# Altium schematic sheet KEYBOARD.SchDoc
size A4; DrawnBy: SURAJ; SheetNumber: 4
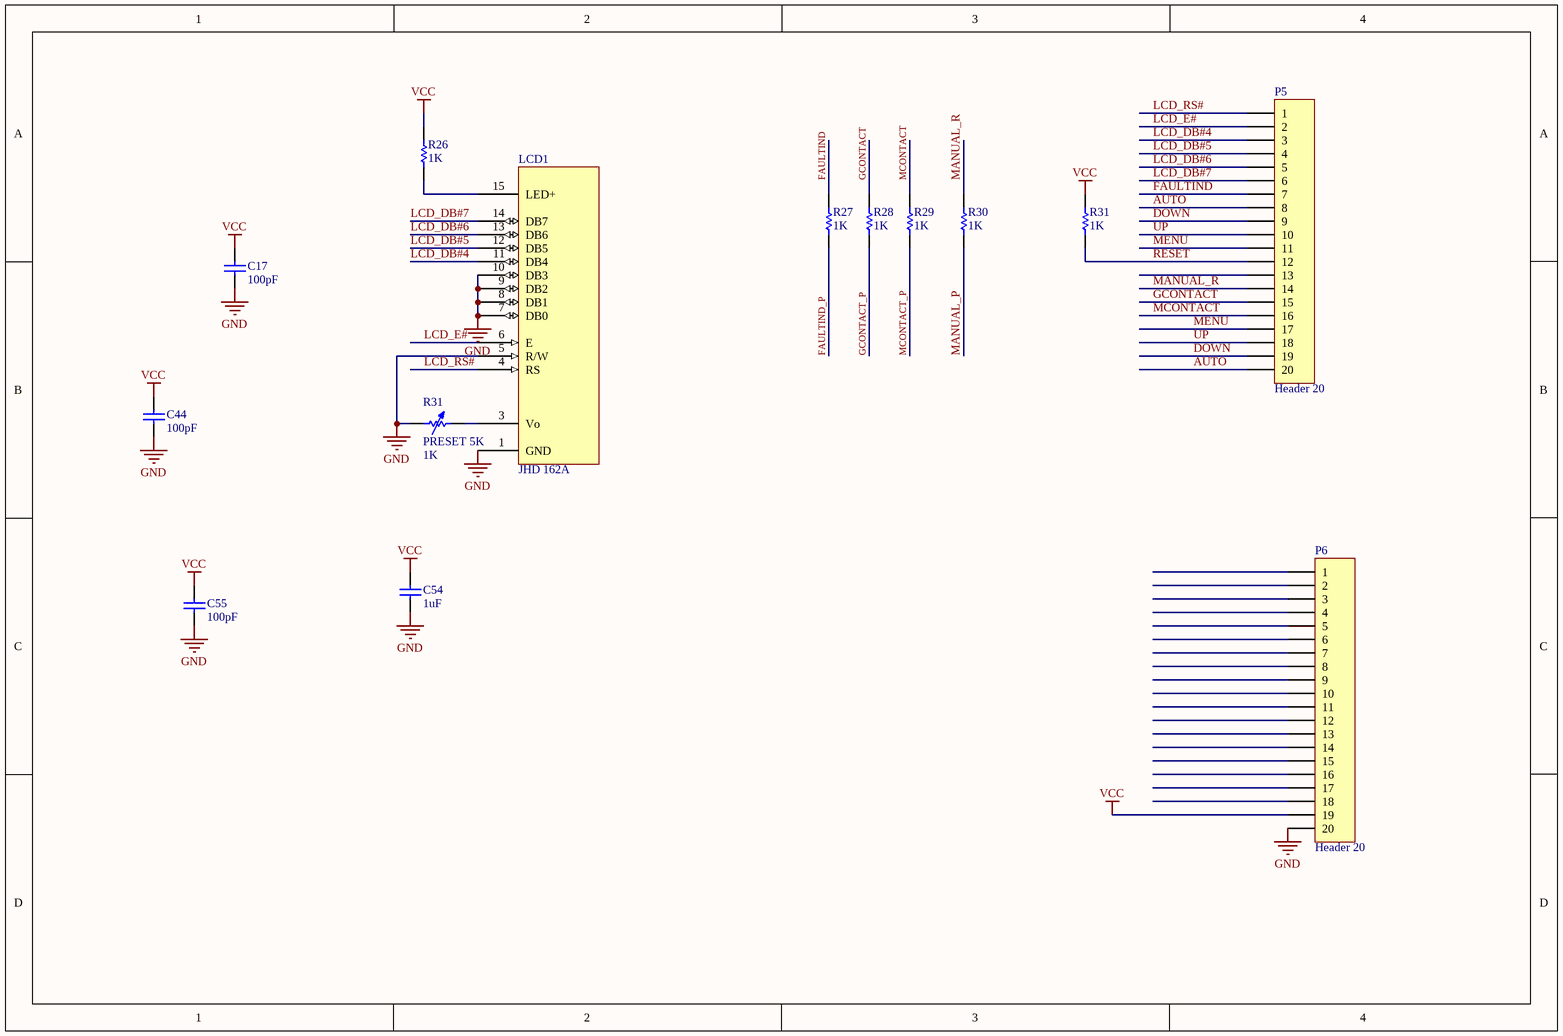
[diagram p0: KEYBOARD.SchDoc]

## Parts
(Parts that share a designator on the sheet are numbered #1, #2 ... from top to bottom, then left to right.)
C17  value 100pF  [C1206]  (hidden comment: .1uF 1206)
C44  value 100pF  [C1206]  (hidden comment: .1uF 1206)
C54  value 1uF  [C1206]  (hidden comment: 1uF 1206)
C55  value 100pF  [C1206]  (hidden comment: .1uF 1206)
LCD1  JHD 162A  [162A]
P5  Header 20  [HDR1X20_BURGE_M]
P6  Header 20  [HDR1X20_BURGE_M]
R26  value 1K  [R1206]  (hidden comment: 470E 1206)
R27  value 1K  [R1206]  (hidden comment: 470E 1206)
R28  value 1K  [R1206]  (hidden comment: 470E 1206)
R29  value 1K  [R1206]  (hidden comment: 470E 1206)
R30  value 1K  [R1206]  (hidden comment: 470E 1206)
R31#1  value 1K  [R1206]  (hidden comment: 4.7K 1206)
R31#2  PRESET 5K  value 1K  [POT]

## Nets
GND: C17.1 C44.1 C54.1 C55.1 LCD1.1(GND) LCD1.5(R/W) LCD1.7(DB0) LCD1.8(DB1) LCD1.9(DB2) LCD1.10(DB3) LCD1.16(LED-) P6.20 R31#2.1
VCC: C17.2 C44.2 C54.2 C55.2 LCD1.2(VDD) P6.19 R26.2 R31#1.1
AUTO: P5.8 P5.20
DOWN: P5.9 P5.19
FAULTIND: P5.7 R27.1
FAULTIND_P: R27.2
GCONTACT: P5.15 R28.1
GCONTACT_P: R28.2
LCD_DB#4: LCD1.11(DB4) P5.3
LCD_DB#5: LCD1.12(DB5) P5.4
LCD_DB#6: LCD1.13(DB6) P5.5
LCD_DB#7: LCD1.14(DB7) P5.6
LCD_E#: LCD1.6(E) P5.2
LCD_RS#: LCD1.4(RS) P5.1
MANUAL_P: R30.2
MANUAL_R: P5.14 R30.1
MCONTACT: P5.16 R29.1
MCONTACT_P: R29.2
MENU: P5.11 P5.17
RESET: P5.12 R31#1.2
UP: P5.10 P5.18
NetLCD1_3: LCD1.3(Vo) R31#2.2
NetLCD1_15: LCD1.15(LED+) R26.1

Not connected (* = marked no-connect by the designer): P5 13; P6 1 2 3 4 5 6 7 8 9 10 11 12 13 14 15 16 17 18

## Library data of the parts
C17 C44 C54 C55 = Cap: Capacitor; Published: 8-Jun-2000; LatestRevisionDate: 17-Jul-2002; LatestRevisionNote: Re-released for DXP Platform.; PackageReference: RAD-0.3; Publisher: Altium Limited; PackageDescription: Radial Cap, Thru-Hole; 2 Leads; 0.3 in Pin Spacing
LCD1 = 162A: 16 char * 2 line LCD character display with b/light
P5 P6 = Header 20: Header, 20-Pin; LatestRevisionDate: 17-Jul-2002; LatestRevisionNote: Re-released for DXP Platform.; Publisher: Altium Limited
R26-R30 R31#1 = Res1: Resistor; Published: 8-Jun-2000; LatestRevisionDate: 17-Jul-2002; LatestRevisionNote: Re-released for DXP Platform.; Publisher: Altium Limited; PackageDescription: Axial Device, Thru-Hole; 2 Leads; 0.3 in Pin Spacing
  R26: PackageReference: AXIAL-0.4
  R27-R30 R31#1: PackageReference: AXIAL-0.3
R31#2 = Res Adj1: Variable Resistor; Set Position: 0.5; Published: 8-Jun-2000; LatestRevisionDate: 17-Jul-2002; LatestRevisionNote: Re-released for DXP Platform.; PackageReference: AXIAL-0.7; Publisher: Altium Limited; PackageDescription: Axial Device, Thru-Hole; 2 Leads; 0.7 in Pin Spacing